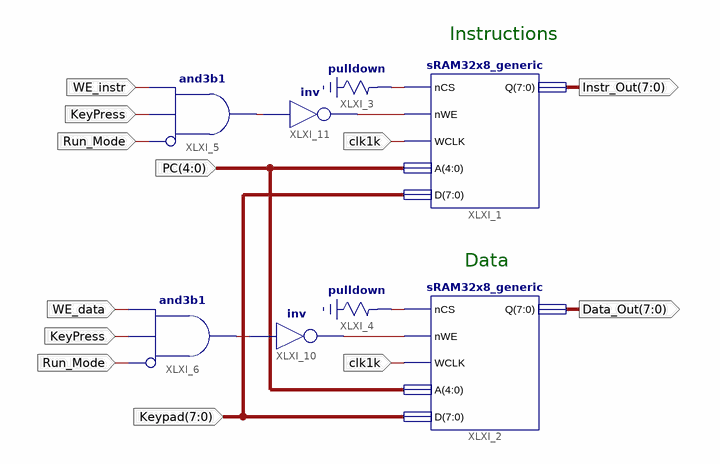
[diagram p0: schematic sheet 1]
// Xilinx ISE schematic Memory.sch (spartan3e) as structural Verilog: 8 symbols, 9 ports
module Memory (
  input  [4:0] PC,
  input  [7:0] Keypad,
  input  clk1k,
  input  WE_instr,
  input  KeyPress,
  input  Run_Mode,
  input  WE_data,
  output [7:0] Instr_Out,
  output [7:0] Data_Out
);

  wire XLXN_1, XLXN_2, XLXN_31, XLXN_32, XLXN_33, XLXN_34;

  sRAM32x8_generic XLXI_1 (.nCS(XLXN_1), .nWE(XLXN_33), .WCLK(clk1k), .A(PC), .D(Keypad), .Q(Instr_Out));
  sRAM32x8_generic XLXI_2 (.nCS(XLXN_2), .nWE(XLXN_34), .WCLK(clk1k), .A(PC), .D(Keypad), .Q(Data_Out));
  \pulldown  XLXI_3 (.O(XLXN_1));
  \pulldown  XLXI_4 (.O(XLXN_2));
  and XLXI_6 (XLXN_31, ~Run_Mode, KeyPress, WE_data);  // and3b1
  and XLXI_5 (XLXN_32, ~Run_Mode, KeyPress, WE_instr);  // and3b1
  not XLXI_10 (XLXN_34, XLXN_31);
  not XLXI_11 (XLXN_33, XLXN_32);

  // Notes on the sheet:
  //   Instructions
  //   Data
endmodule
